# Altium schematic sheet Shema_Leistungsendstufe.SchDoc
size A3; Organization: HSLU T&A; Address1: Abteilung Elektrotechnik; Address2: Technikumsstrasse 21; Address3: CH-6048 Horw
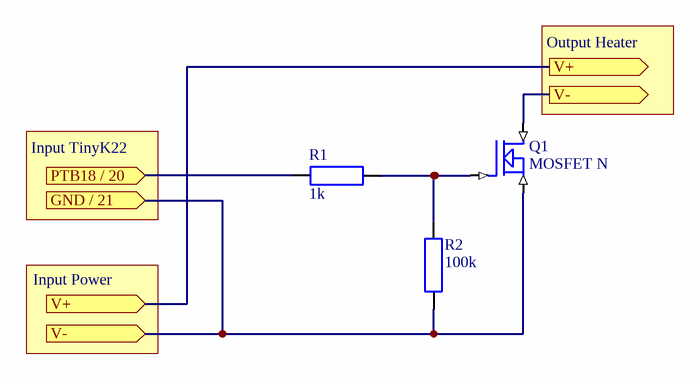
[diagram p0: Shema_Leistungsendstufe.SchDoc]

## Parts
Q1  MOSFET N
R1  1k
R2  100k

## Ports
GND / 21 (in), PTB18 / 20 (in), V+ (in), V+ (out), V- (in), V- (out)

## Nets
GND / 21: Q1.DRAIN Q1.SOURCE R2.2 ; port GND / 21, port V-
PTB18 / 20: R1.1 ; port PTB18 / 20
NetQ1_GATE: Q1.GATE R1.2 R2.1

## Notes on the sheet
- Output Heater
- Input TinyK22
- Input Power
- Project:
- Drawn by:
- Size:
- Sheet
- A3
- Rev.:
- of
- Date:
- File:

## Library data of the parts
R1 R2 = R?: Normaler Widerstand